# Altium schematic sheet MainBoard_V100_BLR.SchDoc
size A4; SheetNumber: 12; SheetTotal: 22; Title_: Base Line Restorer
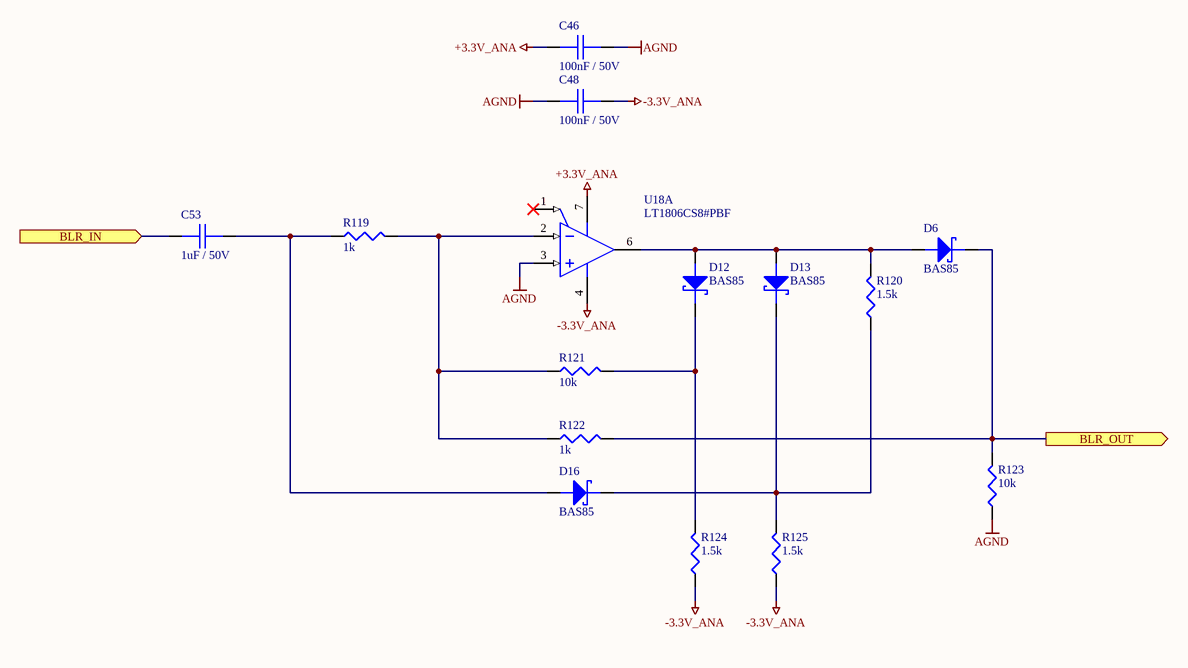
[diagram p0: MainBoard_V100_BLR.SchDoc]

## Parts
C46  100nF / 50V  [0805_C]
C48  100nF / 50V  [0805_C]
C53  1uF / 50V  [0805_C]
D6  BAS85  [SOD80]
D12  BAS85  [SOD80]
D13  BAS85  [SOD80]
D16  BAS85  [SOD80]
R119  1k  [0805]
R120  1.5k  [0805]
R121  10k  [0805]
R122  1k  [0805]
R123  10k  [0805]
R124  1.5k  [0805]
R125  1.5k  [0805]
U18  LT1806CS8#PBF  [SO-8]  (part A of 2)

## Ports
BLR_IN (in), BLR_OUT (out)

## Nets
+3.3V_ANA: C46.1 U18.7(V+)
-3.3V_ANA: C48.2 R124.1 R125.1 U18.4(V-)
AGND: C46.2 C48.1 R123.1 U18.3(+IN)
BLR_IN: C53.1 ; port BLR_IN
BLR_OUT: D6.K R122.2 R123.2 ; port BLR_OUT
NetC53_2: C53.2 D16.A R119.1
NetD6_A: D6.A D12.A D13.A R120.2 U18.6(OUT)
NetD12_K: D12.K R121.2 R124.2
NetD13_K: D13.K D16.K R120.1 R125.2
NetR119_2: R119.2 R121.1 R122.1 U18.2(-IN)

Not connected (* = marked no-connect by the designer): U18 1(~{SHDN})*

## Notes on the sheet
- Board:
- Author:
- Title:
- Project:
- SVN:
- Version:
- Sheet:
- of
- Contact:
- Modified:
- Size:
- A4

## Library data of the parts
C46 C48 = 149: 100nF 50V X7R; Part Number: SMD0805-100nF-50V; Azonosító: 149; Category: Passives; Subcategory: PASS_Capacitor; Supplier 1: HESTORE; Supplier 1 order number: 100.011.22
C53 = 151: 1uF 50V X7R; Part Number: SMD0805-1uF-50V; Azonosító: 151; Category: Passives; Subcategory: PASS_Capacitor; Supplier 1: HESTORE; Supplier 1 order number: 100.330.68
D6 D12 D13 D16 = 371: Small Signal Schottky Diode, Single, 30 V, 200 mA,  125 °C; Azonosító: 371; Part Number: BAS85; Category: Semiconductors; Subcategory: SEMI_Schottky; Supplier 1: HESTORE; Supplier 1 order number: 100.222.42; Supplier 2: FARNELL; Supplier 2 order number: 1097282; Help URL: https://4donline.ihs.com/images/VipMasterIC/IC/NEXP/NEXP-S-A0002881467/NEXP-S-A0002882622-1.pdf?hkey=6D3A4C79FDBF58556ACFDE234799DDF0
R119 R122 = 52: 1k 0805 0.125W 1%; Part Number: SMD0805-1k 1%; Azonosító: 52; Category: Passives; Subcategory: PASS_Resistor; Supplier 1: HESTORE; Supplier 1 order number: 100.312.99
R120 R124 R125 = 379: 1.5k 0805 0.125W 1%; Part Number: SMD0805-1.5k-1%; Azonosító: 379; Category: Passives; Subcategory: PASS_Resistor; Supplier 1: HESTORE; Supplier 1 order number: 100.327.80
R121 R123 = 59: 10k 0805 0.125W 1%; Part Number: SMD0805-10k 1%; Azonosító: 59; Category: Passives; Subcategory: PASS_Resistor; Supplier 1: HESTORE; Supplier 1 order number: 100.403.38
U18 = 353: Single Channel, High Speed, Low Noise Precision Operational Amplifier, 325 MHz Typical GBW, 125 V/us Typical SR, 2.5 to 12.6 V, 8-Pin SOIC; Manufacturer: Linear Technology; Linear Technology Part Number: LT1806; Is (mA) Typical: 9; GBW (MHz) Typical: 325; SR (V/us) Typical: 125; Vos (mV) Guaranteed: 0.55; Vos (mV) Typical: 0.1; Vs Max (V): 12.6; Vs Min (V): 2.5; Channels (#): 1; Azonosító: 353; DatasheetVersion: Rev. C; ComponentLink3Description: Package Specification; Mounting Technology: Surface Mount; ComponentLink2Description: Datasheet; RevisionNote: URLs updated; PackageDescription: 8-Pin Plastic Small Outline, Body 4.9 x 3.9 mm, Pitch 1.27 mm; PackageVersion: Rev G; RoHS: Pb-Free; Type: VFB; PackageReference: LT-S8-8; ComponentLink2URL: http://cds.linear.com/docs/en/datasheet/18067fc.pdf; ComponentLink3URL: http://cds.linear.com/docs/en/packaging/05081610_G_SO8.pdf; PartNumber: LT1806CS8#PBF; ComponentLink1Description: Manufacturer URL; ComponentLink1URL: http://www.linear.com/; Part Number: LT1806CS8#PBF; Category: Integrated Circuits; Subcategory: IC_Analog; Supplier 1: MOUSER; Supplier 1 order number: 584-LT1806CS8#PBF; Help URL: https://hu.mouser.com/datasheet/2/609/18067fc-3124195.pdf